# EAGLE design SOLoRa (EAGLE 9.1.0)
COMPANY: ADAFRUIT INDUSTRIES; DRAWN: KTOWN; REV: B

## Sheet 1 of 2
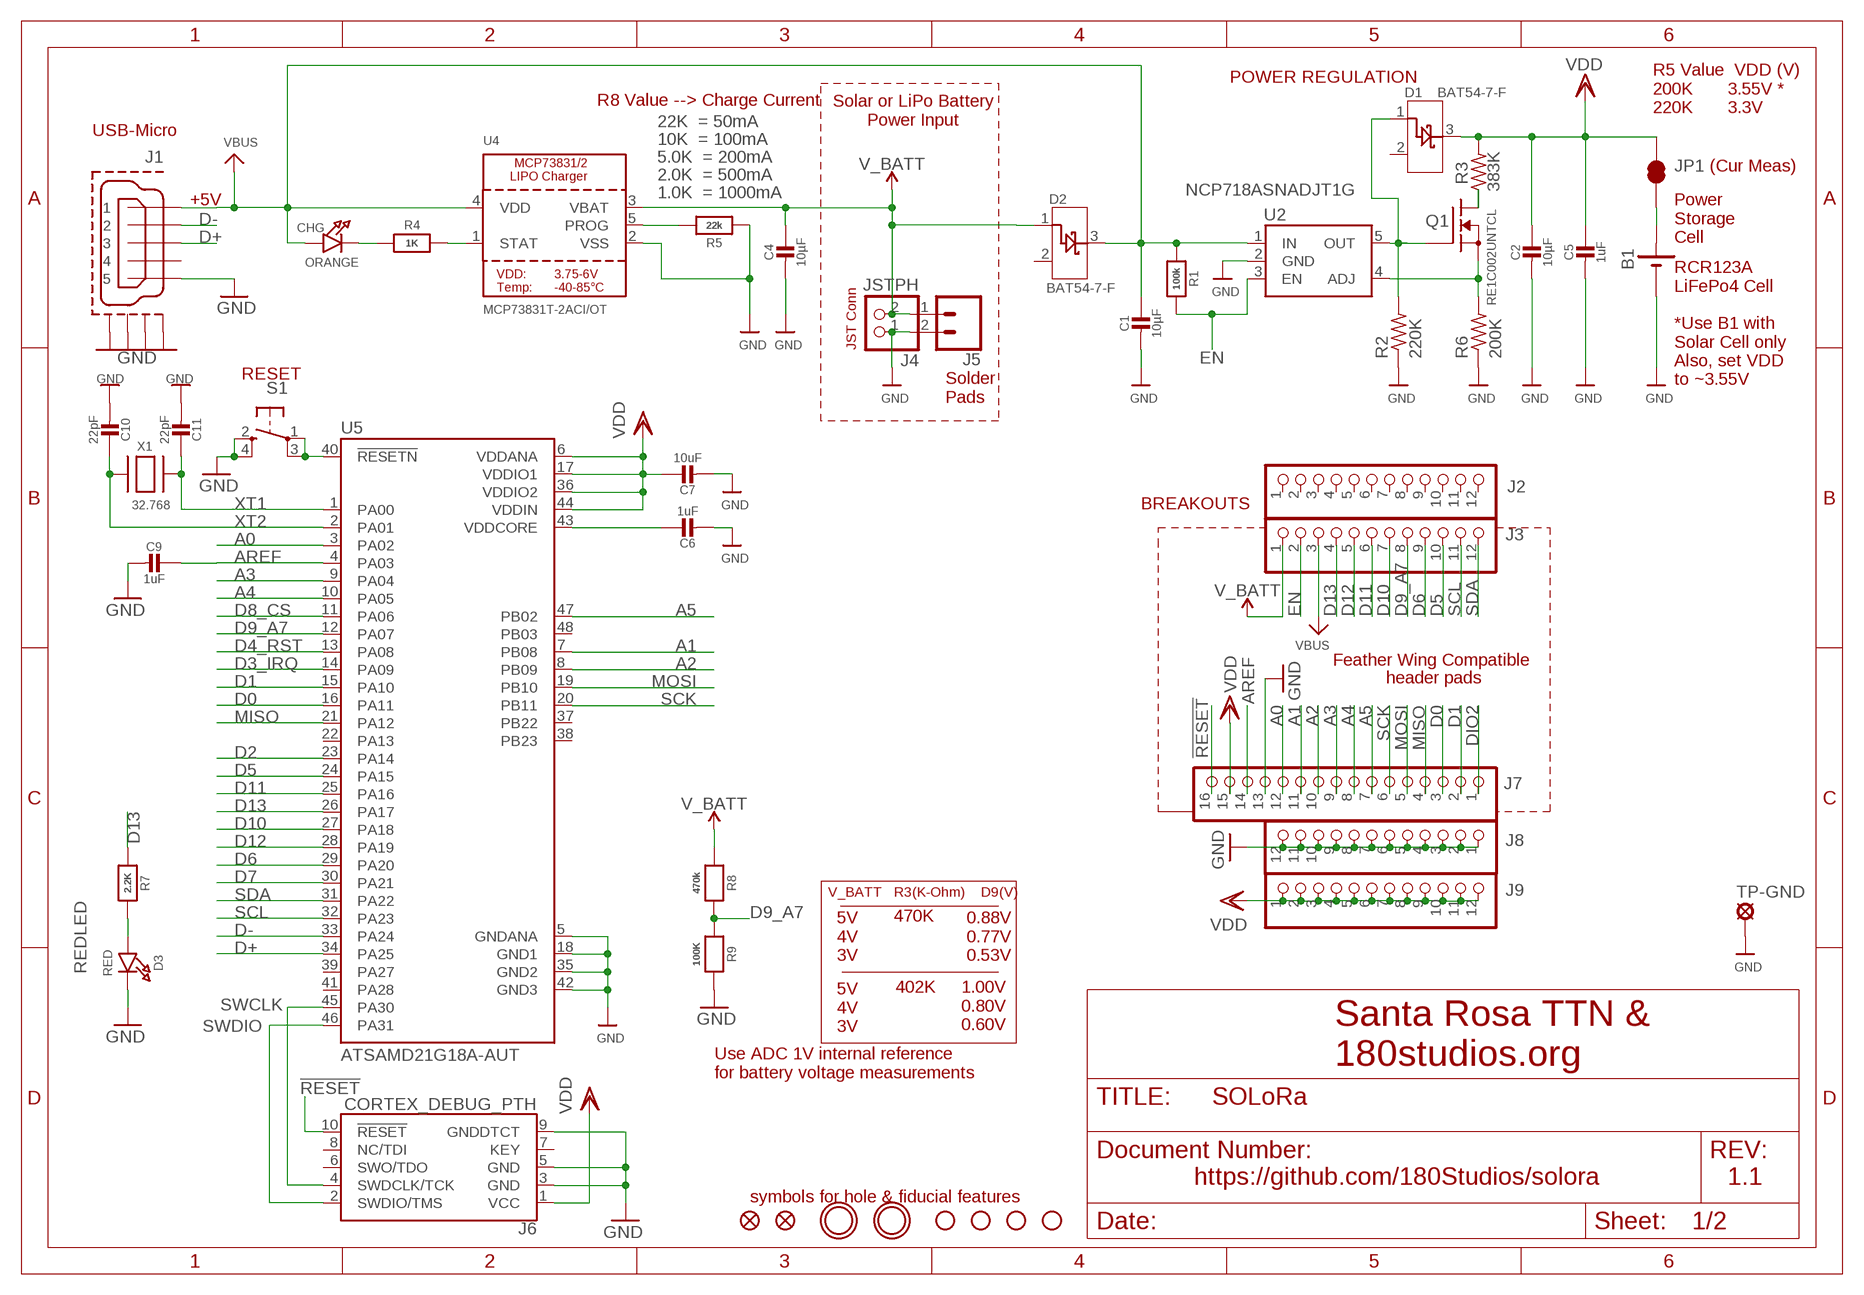
[diagram p0: schematic, sheet 1]

### Parts
$$U$1  FIDUCIAL""  [FIDUCIAL_1MM]
$$U$2  MOUNTINGHOLE2.5  [MOUNTINGHOLE_2.5_PLATED]
$$U$3  MOUNTINGHOLE2.5  [MOUNTINGHOLE_2.5_PLATED]
$$U$4  FIDUCIAL""  [FIDUCIAL_1MM]
B1  BH123A  [BH123A]
C1  10µF  CAP_CERAMIC0805-NOOUTLINE  [0805-NO]
C2  10µF  CAP_CERAMIC0805-NOOUTLINE  [0805-NO]
C4  10µF  CAP_CERAMIC0805-NOOUTLINE  [0805-NO]
C5  1uF  CAP_CERAMIC0603_NO  [0603-NO]
C6  1uF  CAP_CERAMIC0603_NO  [0603-NO]
C7  10uF  CAP_CERAMIC0805-NOOUTLINE  [0805-NO]
C9  1uF  CAP_CERAMIC0603_NO  [0603-NO]
C10  22pF  CAP_CERAMIC0603_NO  [0603-NO]
C11  22pF  CAP_CERAMIC0603_NO  [0603-NO]
CHG  ORANGE  LED0805_NOOUTLINE  [CHIPLED_0805_NOOUTLINE]
D1  BAT54-7-F  [SOT-23]
D2  BAT54-7-F  [SOT-23]
D3  RED  LED0805_NOOUTLINE  [CHIPLED_0805_NOOUTLINE]
H1  STAND-OFF  [STAND-OFF]
H2  STAND-OFF  [STAND-OFF]
H3  STAND-OFF  [STAND-OFF]
H4  STAND-OFF  [STAND-OFF]
J1  CONN_USB-MIRCO_10118194  [10118194_USB]
J2  HEADER-1X12  [1X12_ROUND]
J3  HEADER-1X12  [1X12_ROUND]
J4  JSTPH  CON_JST_PH_2PIN  [JSTPH2]
J5  CONN_021X02_NO_SILK  [1X02_NO_SILK]
J6  CORTEX_DEBUG_PTH  [2X5-PTH-1.27MM]
J7  HEADER-1X16ROUND  [1X16_ROUND]
J8  HEADER-1X12  [1X12_ROUND]
J9  HEADER-1X12  [1X12_ROUND]
JP1  JUMPER-SMT_2_NC_TRACE_NO-SILK  [SMT-JUMPER_2_NC_TRACE_NO-SILK]
Q1  RE1C002UNTCL  [SOT50P160X85-3N]
R1  100k  RESISTOR_0603_NOOUT  [0603-NO]
R2  220K  R-US_R0603  [R0603]
R3  383K  R-US_R0603  [R0603]
R4  1K  RESISTOR_0603_NOOUT  [0603-NO]
R5  22k  RESISTOR_0603_NOOUT  [0603-NO]
R6  200K  R-US_R0603  [R0603]
R7  2.2K  RESISTOR_0603_NOOUT  [0603-NO]
R8  470k  RESISTOR_0603_NOOUT  [0603-NO]
R9  100K  RESISTOR_0603_NOOUT  [0603-NO]
S1  SPST_TACT-KMR2  [KMR2]
TP-GND  SE14  [SE14]
U2  NCP718ASNADJT1G  [SOT95P280X100-5N]
U4  MCP73831T-2ACI/OT  MCP73831/2  [SOT23-5]
U5  ATSAMD21G18A-AUT  [QFP50P900X900X120-48N]
X1  32.768  XTAL-3.2X1.5  [XTAL3215]

### Nets
!RESET: J6.10(!RESET) J7.16 S1.1(P) S1.3(P1) U5.40(!RESETN)
A0: J7.12 U5.3(PA02)
A1: J7.11 U5.7(PB08)
A2: J7.10 U5.8(PB09)
A3: J7.9 U5.9(PA04)
A4: J7.8 U5.10(PA05)
A5: J7.7 U5.47(PB02)
ADJ1: Q1.3(D) R3.1
AREF: C9.1 J7.14 U5.4(PA03)
CHGLED: CHG.C R4.1
D0: J7.3 U5.16(PA11)
D1: J7.2 U5.15(PA10)
D2: U5.23(PA14)
D3_IRQ: U5.14(PA09) ; also sheet 2
D4_RST: U5.13(PA08) ; also sheet 2
D5: J3.10 U5.24(PA15)
D6: J3.9 U5.29(PA20) ; also sheet 2
D7: U5.30(PA21)
D8_CS: U5.11(PA06) ; also sheet 2
D9_A7: J3.8 R8.2 R9.1 U5.12(PA07)
D10: J3.7 U5.27(PA18)
D11: J3.6 U5.25(PA16) ; also sheet 2
D12: J3.5 U5.28(PA19)
D13: J3.4 R7.1 U5.26(PA17)
D+: J1.3 U5.34(PA25)
D-: J1.2 U5.33(PA24)
DIO2: J7.1 ; also sheet 2
EN: J3.2 R1.2 U2.3(EN)
GND [Power]: B1.MINUS C1.2 C2.2 C4.2 C5.2 C6.2 C7.2 C9.2 C10.2 C11.2 D3.C J1.5 J1.6(GND1) J1.7(GND2) J1.8(GND3) J1.9(GND4) J4.1 J5.2 J6.3(GND) J6.5(GND) J6.9(GNDDTCT) J7.13 J8.1 J8.2 J8.3 J8.4 J8.5 J8.6 J8.7 J8.8 J8.9 J8.10 J8.11 J8.12 R2.1 R5.2 R6.1 R9.2 S1.2(S) S1.4(S1) TP-GND.MP U2.2(GND) U4.2(VSS) U5.5(GNDANA) U5.18(GND1) U5.35(GND2) U5.42(GND3) ; also sheet 2
MISO: J7.4 U5.21(PA12) ; also sheet 2
MOSI: J7.5 U5.19(PB10) ; also sheet 2
PLUS [Power]: B1.PLUS JP1.1
PROG: R5.1 U4.5(PROG)
REDLED: D3.A R7.2
REGADJ: Q1.2(S) R6.2 U2.4(ADJ)
REGOUT: D1.1(EPAD1) Q1.1(G) R2.2 U2.5(OUT)
SCK: J7.6 U5.20(PB11) ; also sheet 2
SCL: J3.11 U5.32(PA23) ; also sheet 2
SDA: J3.12 U5.31(PA22) ; also sheet 2
STAT: R4.2 U4.1(STAT)
SWCLK: J6.4(SWDCLK/TCK) U5.45(PA30)
SWDIO: J6.2(SWDIO/TMS) U5.46(PA31)
V_BATT: C4.1 D2.1(EPAD1) J3.1 J4.2 J5.1 R8.1 U4.3(VBAT)
VBUS: C1.1 CHG.A D2.3(EPAD3) J1.1 J3.3 R1.1 U2.1(IN) U4.4(VDD)
VDD [Power]: C2.1 C5.1 C7.1 D1.3(EPAD3) J6.1(VCC) J7.15 J9.1 J9.2 J9.3 J9.4 J9.5 J9.6 J9.7 J9.8 J9.9 J9.10 J9.11 J9.12 JP1.2 R3.2 U5.6(VDDANA) U5.17(VDDIO1) U5.36(VDDIO2) U5.44(VDDIN) ; also sheet 2
VDDCORE: C6.1 U5.43(VDDCORE)
XT1: C11.1 U5.1(PA00) X1.P$1
XT2: C10.1 U5.2(PA01) X1.P$2
Unconnected: D1.2(EPAD2) D2.2(EPAD2) J1.4 J2.1 J2.2 J2.3 J2.4 J2.5 J2.6 J2.7 J2.8 J2.9 J2.10 J2.11 J2.12 J6.6(SWO/TDO) J6.7(KEY) J6.8(NC/TDI) U5.22(PA13) U5.37(PB22) U5.38(PB23) U5.39(PA27) U5.41(PA28) U5.48(PB03)

### Notes on the sheet
- POWER REGULATION
- R8 Value --> Charge Current
- R5 Value  VDD (V)
  200K       3.55V *
  220K       3.3V
- Solar or LiPo Battery
  Power Input
- 22K  = 50mA
- USB-Micro
- 10K  = 100mA
- 5.0K  = 200mA
- (Cur Meas)
- 2.0K  = 500mA
- 1.0K  = 1000mA
- +5V
- Power
  Storage
  Cell
- JST Conn
- RESET
- RCR123A
  LiFePo4 Cell
  
  *Use B1 with 
  Solar Cell only 
  Also, set VDD
  to ~3.55V
- Solder
  Pads
- BREAKOUTS
- Feather Wing Compatible
- header pads
- V_BATT   R3(K-Ohm)    D9(V)
- 470K
- 5V
  4V
  3V
- 0.88V
  0.77V
  0.53V
- 402K
- 1.00V
  0.80V
  0.60V
- 5V
  4V
  3V
- Santa Rosa TTN &
  180studios.org
- Use ADC 1V internal reference
  for battery voltage measurements
- https://github.com/180Studios/solora | 1.1
- symbols for hole & fiducial features

## Sheet 2 of 2
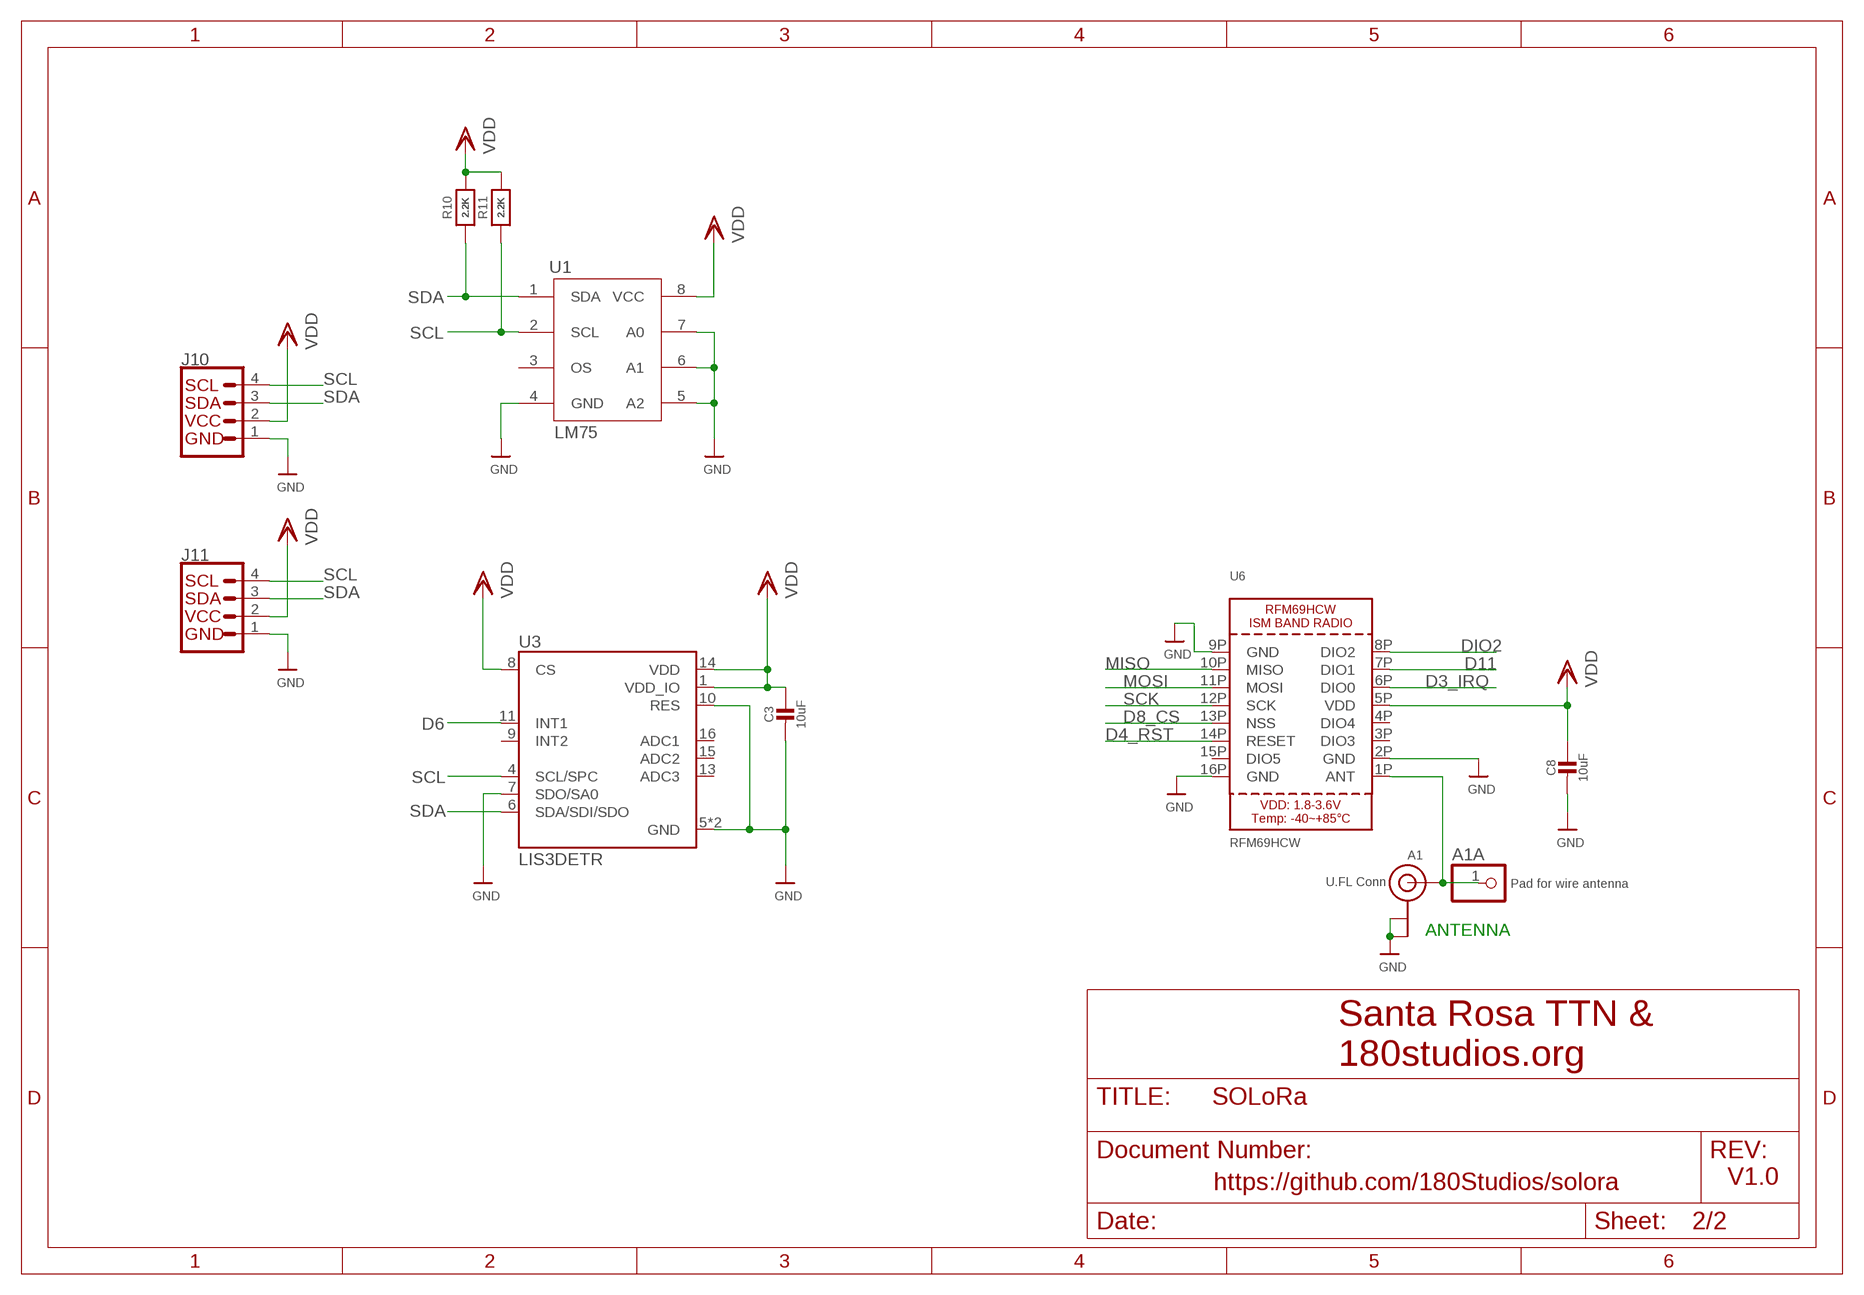
[diagram p1: schematic, sheet 2]

### Parts
A1  U.FL Conn  ANTENNA_U.FL  [U.FL]
A1A  Pad for wire antenna  HEADER-1X1ROUND  [1X01_ROUND]
C3  10uF  CAP_CERAMIC0805-NOOUTLINE  [0805-NO]
C8  10uF  CAP_CERAMIC0805-NOOUTLINE  [0805-NO]
J10  QWIIC_CONNECTORJS-1MM  [1X04_1MM_RA]
J11  QWIIC_CONNECTORJS-1MM  [1X04_1MM_RA]
R10  2.2K  RESISTOR_0603_NOOUT  [0603-NO]
R11  2.2K  RESISTOR_0603_NOOUT  [0603-NO]
U1  LM75  [SO8]
U3  LIS3DETR  [LGA16R50P5X3_300X300X100N]
U6  RFM69HCW  RFM69HCW_SMT  [RFMHCW_SMT]

### Nets
ANT: A1.3(SIGNAL) A1A.1 U6.1P(ANT)
D3_IRQ: U6.6P(DIO0) ; also sheet 1
D4_RST: U6.14P(RESET) ; also sheet 1
D6: U3.11(INT1) ; also sheet 1
D8_CS: U6.13P(NSS) ; also sheet 1
D11: U6.7P(DIO1) ; also sheet 1
DIO2: U6.8P(DIO2) ; also sheet 1
GND [Power]: A1.1(GND) A1.2(GND) C3.2 C8.2 J10.1 J11.1 U1.4(GND) U1.5(A2) U1.6(A1) U1.7(A0) U3.5(GND) U3.7(SDO/SA0) U3.10(RES) U3.12(GND) U6.2P(GND) U6.9P(GND) U6.16P(GND) ; also sheet 1
MISO: U6.10P(MISO) ; also sheet 1
MOSI: U6.11P(MOSI) ; also sheet 1
SCK: U6.12P(SCK) ; also sheet 1
SCL: J10.4 J11.4 R11.1 U1.2(SCL) U3.4(SCL/SPC) ; also sheet 1
SDA: J10.3 J11.3 R10.1 U1.1(SDA) U3.6(SDA/SDI/SDO) ; also sheet 1
VDD [Power]: C3.1 C8.1 J10.2 J11.2 R10.2 R11.2 U1.8(VCC) U3.1(VDD_IO) U3.8(CS) U3.14(VDD) U6.5P(VDD) ; also sheet 1
Unconnected: U1.3(OS) U3.9(INT2) U3.13(ADC3) U3.15(ADC2) U3.16(ADC1) U6.3P(DIO3) U6.4P(DIO4) U6.15P(DIO5)

### Notes on the sheet
- ANTENNA
- Santa Rosa TTN &
  180studios.org
- https://github.com/180Studios/solora | V1.0

## Library data of the parts
$$U$1 $$U$4 = microbuilder:FIDUCIAL: Fiducial Alignment Points Various fiducial points for machine vision alignment.; BOM: EXCLUDE
$$U$2 $$U$3 = microbuilder:MOUNTINGHOLE: Mounting Hole For #2 screws (0.086"/2.18mm width, 0.094"/2.4mm hole) use 2.5mm; BOM: EXCLUDE
A1 = microbuilder:ANTENNA_U.FL: U.FL Antenna Connector
A1A = microbuilder:HEADER-1X1: PIN HEADER
B1 = _Joes:BH123A
C1-C11 = microbuilder:CAP_CERAMIC: Ceramic Capacitors For new designs, use the packages preceded by an '_' character since they are more reliable: The following footprints should be used on most boards: _0402 - Standard footprint for regular board layouts _0603 - Standard footprint for regular board layouts _0805 - Standard footprint for regular board layouts _1206 - Standard footprint for regular board layouts For extremely tight-pitch boards where space is at a premium, the following 'micro-pitch' footprints can be used (smaller pads, no silkscreen outline, etc.): _0402MP - Micro-pitch footprint for very dense/compact boards _0603MP - Micro-pitch footprint for very dense/compact boards _0805MP - Micro-pitch footprint for very dense/compact boards _1206MP - Micro-pitch footprint for very dense/compact boards
CHG D3 = microbuilder:LED: LED 0603 - 0603 Surface Mount Package 2mA: Green LED - Low Power (3.9mcd, 2ma, 1.7Vf) - Digikey: 475-2709-2-ND Orange LED - Low Power (9.8mcd, 2ma, 1.8Vf) - Digikey: 475-1194-2-ND Red LED - Low Power (5mcd, 2ma, 1.8Vf) - Digikey: 475-1195-2-ND Yellow LED - Low Power (7mcd, 2ma, 1.8Vf) - Digikey: 475-1196-2-ND 5mA: Blue LED - Low Power (17mcd, 5ma, 2.9Vf) - Digikey: LNJ937W8CRACT-ND 0805 - 0805 Surface Mount Package 2mA: Red LED (8.8mcd, 2mA, 1.8Vf, Clear) - Low Power [Digikey: 475-2510-1-ND] Green LED (5mcd, 2mA, 1.8Vf, Clear) - Low Power [Digikey: 475-2730-1-ND] Yellow LED (11.3mcd, 2mA, 1.8Vf, Clear) - Low Power [Digikey: 475-2555-1-ND] 20mA: Red LED (104mcd, 20mA, Diffused) - LS R976 [Digikey: 475-1278-6-ND] Red LED (12mcd, 20mA, 2.0Vf, Clear) - APT2012EC [Digikey: 754-1128-1-ND] Green LED (15mcd, 20mA, 2.2Vf, Clear) - APT2012GC [Digikey: 754-1131-1-ND] Orange LED (160mcd, 20mA, 2.1Vf, Clear) - APT2012SECK [Digikey: 754-1130-1-ND] 1206 - 1206 Surface Mount Package Green LED (26mcd, 20mA, Diffused) - LG N971 [Digikey: 475-1407-6-ND] Red LED (15mcd, 20mA, Diffused) - LH N974 [Digikey: 475-1416-6-ND] Cree - Cree High-Power Surface Mount LEDs XPEBWT-L1-0000-00D50 - White 111lm 350mA 2.9Vf 6200K 110° XTEAWT-00-0000-00000LEE3 - White 114lm 350mA 2.85Vf 5000K 115° Everlight - Everlight 45-21 Series Surface Mount LEDs 45-21/QK2C-B2832AC2CB2/2T - Warm White 2000mcd 20mA 3.25Vf 3050K 120° 45-21/LK2C-B38452C4CB2/2T - Nuetral White 2000mcd 20mA 3.25Vf 4150K 120° 45-21/LK2C-B50634C6CB2/2T - Cold White 2200mcd 20mA 3.25Vf 5650K 120° PLCC2 Reverse Mount LS T77K-J1L2-1-0-2-R18-Z - Red 11.25mcd 2mA 1.8Vf 630nm 120° LO T77K-L1M2-24-Z - Orange 19.6mcd 2mA 1.8Vf 606nm 120° LY T77K-K2M1-26-Z - Yellow 15.7mcd 2mA 1.8Vf 587nm 120°
D1 D2 = _Joes:BAT54-7-F; MANUFACTURER_PART_NUMBER: BAT547F; VENDOR: Diodes Inc
H1-H4 = SparkFun-Hardware:STAND-OFF: Stand Off Drill holes for mechanically mounting via screws, standoffs, etc. Note: Use the keepout ring to avoid running the screw head into surrounding components. Variant Overviews STAND-OFF - Mechanical footprint for a #4 phillips button head screw. STAND-OFF-TIGHT - Mechanical footprint for a #4 phillips button head screw, Example SparkFun Products Screw - Phillips Head (1/4", 4-40, 10 pack) <https://www.sparkfun.com/products/10453> (PRT-10453) Screw - Phillips Head (1/2", 4-40, 10 pack) <https://www.sparkfun.com/products/10452> (PRT-10452) Screw - Phillips Head (3/4", 4-40, 10 pack) <https://www.sparkfun.com/products/10451> (PRT-10451) Screw - Phillips Head (1", 4-40, 10 pack) <https://www.sparkfun.com/products/10450> (PRT-10450)
J1 = _Joes:CONN_USB-MIRCO_10118194: CONN USB Micro Receptical SMT & PTH R/A Ampenol FCI 10118194-001LF
J2 J3 J8 J9 = microbuilder:HEADER-1X12
J4 = microbuilder:CON_JST_PH_2PIN: JST 2-Pin Right-Angle Connector PH-Series - 4UConnector: 17311 SH-Series - 4UConnector: 07278
J5 = SparkFun-Connectors:CONN_02: Multi connection point. Often used as Generic Header-pin footprint for 0.1 inch spaced/style header connections On any of the 0.1 inch spaced packages, you can populate with these: Break Away Headers - Straight <https://www.sparkfun.com/products/116> (PRT-00116) Break Away Male Headers - Right Angle <https://www.sparkfun.com/products/553> (PRT-00553) Female Headers <https://www.sparkfun.com/products/115> (PRT-00115) Break Away Headers - Machine Pin <https://www.sparkfun.com/products/117> (PRT-00117) Break Away Female Headers - Swiss Machine Pin <https://www.sparkfun.com/products/743> (PRT-00743) For SCREWTERMINALS and SPRING TERMINALS visit here: Screw Terimnals on SparkFun.com <https://www.sparkfun.com/search/results?term=Screw+Terminals> (5mm/3.5mm/2.54mm spacing) This device is also useful as a general connection point to wire up your design to another part of your project. Our various solder wires solder well into these plated through hole pads. Hook-Up Wire - Assortment (Stranded, 22 AWG) <https://www.sparkfun.com/products/11375> (PRT-11375) Hook-Up Wire - Assortment (Solid Core, 22 AWG) <https://www.sparkfun.com/products/11367> (PRT-11367) View the entire wire category on our website here <https://www.sparkfun.com/categories/141> Special notes: Molex polarized connector foot print use with: PRT-08233 with associated crimp pins and housings. 2.54_SCREWTERM for use with PRT-10571. 3.5mm Screw Terminal footprints for PRT-08084 5mm Screw Terminal footprints for use with PRT-08432
J6 = SparkFun-Connectors:CORTEX_DEBUG: Cortex Debug Connector - 10 pin Supports JTAG debug, Serial Wire debug, and Serial Wire Viewer. PTH and SMD connector options available. General Connector Information <http://infocenter.arm.com/help/topic/com.arm.doc.faqs/attached/13634/cortex_debug_connectors.pdf> Products: PTH Connector <http://www.digikey.com/product-detail/en/cnc-tech/3220-10-0100-00/1175-1627-ND/3883661> -via Digi-Key SparkFun PSoc <https://www.sparkfun.com/products/13229> SparkFun T <https://www.sparkfun.com/products/13810>
J7 = microbuilder:HEADER-1X16: PIN HEADER
J10 J11 = SparkFun-Connectors:QWIIC_CONNECTOR: SparkFun I2C Standard Qwiic Connector An SMD 1mm pitch JST connector makes it easy and quick (get it? Qwiic?) to connect I2C devices to each other. The Qwiic system <http://www.sparkfun.com/qwiic> enables fast and solderless connection between popular platforms and various sensors and actuators. We carry 200mm <https://www.sparkfun.com/products/14204>, 100mm <https://www.sparkfun.com/products/14205>, 50mm <https://www.sparkfun.com/products/14206>, and breadboard friendly <https://www.sparkfun.com/products/14207> Qwiic cables. We also offer 10 pcs strips <https://www.sparkfun.com/products/14323> the SMD connectors.; PROD_ID: CONN-13694
JP1 = SparkFun-Jumpers:JUMPER-SMT_2_NC_TRACE: Normally closed trace jumper This jumper has a trace between two pads so it's normally closed (NC). Use a razor knife to open the connection. For best results follow the IPC guidelines for cutting traces: Cutout at least 0.063 mm (0.005 in). Remove all loose material to clean up the cut area. Seal the cut with an approved epoxy. Reapply solder to reclose the connection.
Q1 = SamacSys_Parts:RE1C002UNTCL: MOSFET 1.2V Drive Nch MOSFET Source: Datasheet <http://rohmfs.rohm.com/en/products/databook/datasheet/discrete/transistor/mosfet/re1c002un.pdf>; ARROW_PART_NUMBER: RE1C002UNTCL; ARROW_PRICE/STOCK: http://uk.rs-online.com/web/p/products/1246784P; DESCRIPTION: MOSFET 1.2V Drive Nch MOSFET; HEIGHT: 0.85mm; MANUFACTURER_NAME: ROHM Semiconductor; MANUFACTURER_PART_NUMBER: RE1C002UNTCL; RS_PART_NUMBER: 1246784P; RS_PRICE/STOCK: http://uk.rs-online.com/web/p/products/1246784P
R1 R4 R5 R7-R11 = microbuilder:RESISTOR: Resistors For new designs, use the packages preceded by an '_' character since they are more reliable: The following footprints should be used on most boards: _0402 - Standard footprint for regular board layouts _0603 - Standard footprint for regular board layouts _0805 - Standard footprint for regular board layouts _1206 - Standard footprint for regular board layouts For extremely tight-pitch boards where space is at a premium, the following 'micro-pitch' footprints can be used (smaller pads, no silkscreen outline, etc.): _0402MP - Micro-pitch footprint for very dense/compact boards _0603MP - Micro-pitch footprint for very dense/compact boards _0805MP - Micro-pitch footprint for very dense/compact boards _1206MP - Micro-pitch footprint for very dense/compact boards
R2 R3 R6 = rcl:R-US_: RESISTOR, American symbol; SPICEPREFIX: R
S1 = adafruit:SPST_TACT: SMT 6mm switch, EVQQ2 series http://www.ladyada.net/library/eagle
TP-GND = solpad:SE14: SOLDER PAD E1553, drill 1,4mm, distributor Buerklin, 07F820
U1 = _Joes:LM75
U2 = SamacSys_Parts:NCP718ASNADJT1G: LDO Regulator, 300 mA, Low Iq, Wide Input Voltage Adjustable, Active Discharge Source: Datasheet <http://www.onsemi.com/pub/Collateral/NCP718-D.PDF>; ARROW_PART_NUMBER: NCP718ASNADJT1G; ARROW_PRICE/STOCK: https://www.arrow.com/en/products/ncp718asnadjt1g/on-semiconductor; DESCRIPTION: LDO Regulator, 300 mA, Low Iq, Wide Input Voltage Adjustable, Active Discharge; HEIGHT: 1mm; MANUFACTURER_NAME: ON Semiconductor; MANUFACTURER_PART_NUMBER: NCP718ASNADJT1G; RS_PART_NUMBER: 1723327; RS_PRICE/STOCK: http://uk.rs-online.com/web/p/products/1723327
U3 = LIS3DETR:LIS3DETR: MEMS digital output motion sensor ultra low-power high performance 3-axes "nano" accelerometer; DESCRIPTION: MEMS digital output motion sensor ultra low-power high performance 3-axes nano accelerometer; DIGI-KEY_PART_NUMBER: 497-16262-1-ND; DIGI-KEY_PURCHASE_URL: https://www.digikey.com/product-detail/en/stmicroelectronics/LIS3DETR/497-16262-1-ND/5799914?utm_source=snapeda&utm_medium=aggregator&utm_campaign=symbol; MF: STMicroelectronics; MP: LIS3DETR; PACKAGE: LGA-16 STMicroelectronics
U4 = microbuilder:MCP73831/2: MCP73831/2 LIPO Charger VDD: 3.75 - 6V Temp -40 - 85°C Programmable Charge Rate: 15-500mA NOTE: STAT is a tri-state logic output on the MCP73831 and an open-drain output on the MCP73832. SOT23-5 with 4.2V output and tri-state logic on STAT = MCP73831T-2ACI/OT
U5 = _Joes:ATSAMD21G18A-AUT: Cortex-M0+, 256KB FLASH, 32KB SRAM, USB, DMA, T&R - 48TQFP IND TEMP, GREEN, 1.6-3.6V, 48MHz; DESCRIPTION: MCU 32-bit SAM D21 ARM Cortex M0+ RISC 256KB Flash 3.3V 48-Pin TQFP T/R; DIGI-KEY_PART_NUMBER: ATSAMD21G18A-AUTCT-ND; DIGI-KEY_PURCHASE_URL: https://www.digikey.com/product-detail/en/microchip-technology/ATSAMD21G18A-AUT/ATSAMD21G18A-AUTCT-ND/4878879?utm_source=snapeda&utm_medium=aggregator&utm_campaign=symbol; MF: Microchip; MP: ATSAMD21G18A-AUT; PACKAGE: TQFP-48 Microchip
U6 = microbuilder:RFM69HCW: RFM69HCW - ISM Band RF Transceiver
X1 = adafruit2:XTAL: Low cost SMT crystals, no capacitors included http://www.ladyada.net/library/eagle

## Net classes
0 default: width 0.152 mm, drill 0.35 mm, clearance 0.152 mm
1 Power: width 0.406 mm, drill 0.35 mm, clearance 0.152 mm

## Board
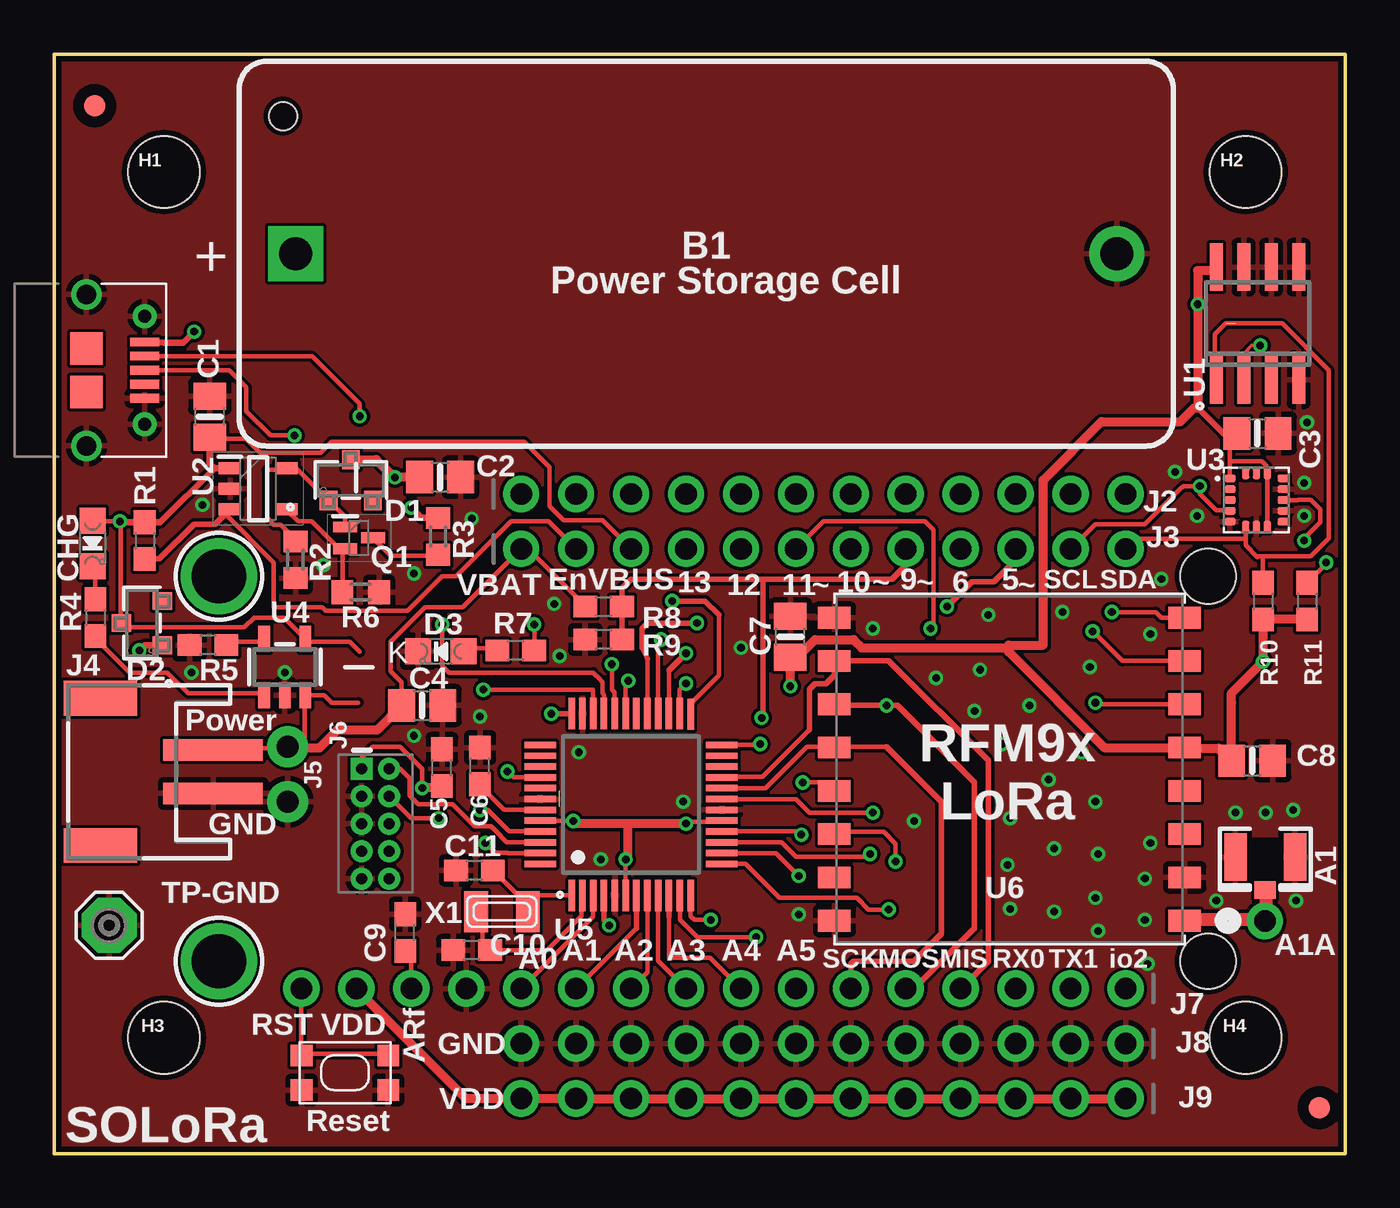
[diagram p2: board, top side]
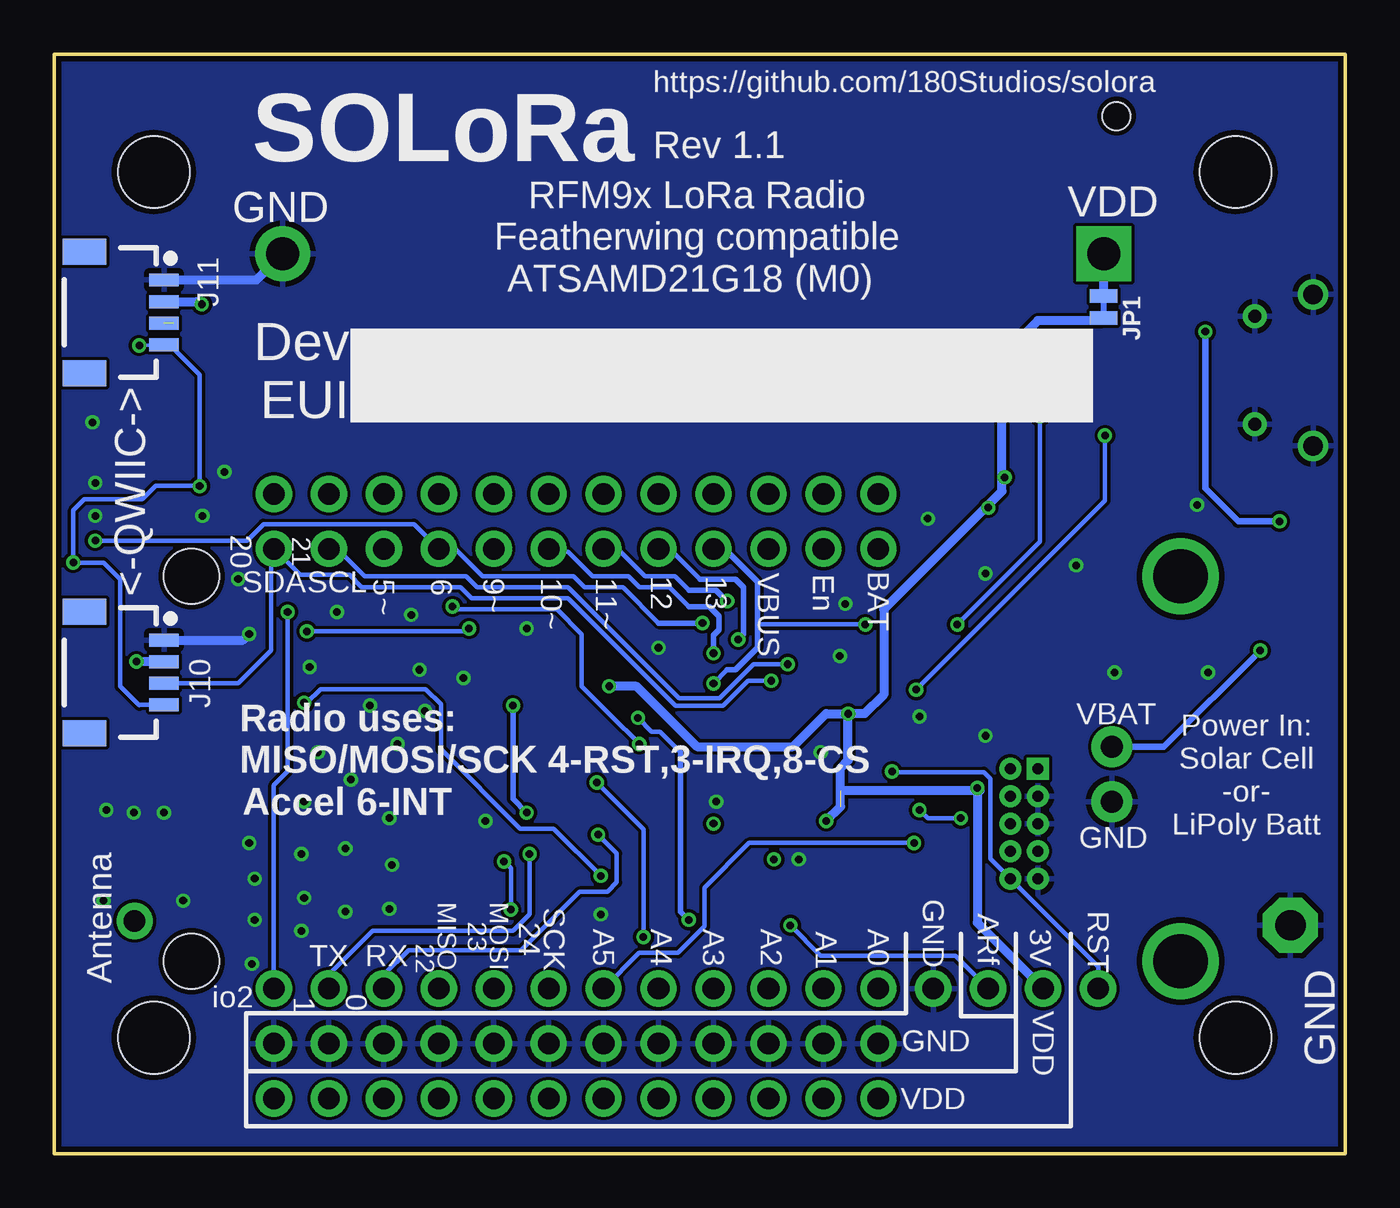
[diagram p3: board, bottom side, seen from below]

Size 59.69 x 50.8 mm. Coordinates in mm from the lower left corner, seen from the top.
Outline: 0,0 59.69,0 59.69,50.8 0,50.8 0,0
Copper layers (1*16): Top 0.035mm / dielectric 1.5mm / Bottom 0.035mm
Design rules "SeeedStudio_2layer_DRU_no_angle_20140221 *": minimum track width 6mil, minimum drill 12mil, track to track 6mil, track to pad 6mil, pad to pad 6mil, via to via 6mil, smd to smd 0mil, copper to edge 10mil, drill to drill 10mil, minimum pad ring 10mil, minimum via ring 6mil, stop-mask expansion 2mil, vias tented up to drill 100mil, thermal gap 10mil
Holes 2.54 mm at 53.34,26.67 53.34,8.89
tRestrict: area 30,13.1 to 30.1,15.1; area 30,16.3 to 30.1,18.9; area 25.8,19.4 to 29.5,19.6; area 23.2,17.3 to 23.4,18.9; area 23.2,16.8 to 23.4,17; area 23.2,15.7 to 23.4,16; area 23.2,13.2 to 23.4,15; area 23.7,12.7 to 25.5,12.8; area 26.8,12.7 to 29.5,12.8; area 24.8,19.4 to 25.7,19.6

### Footprints (pad centres in the part's own frame; a part is rotated, then mirrored left to right if it is on the bottom)
FIDUCIAL_1MM = smd 1 x 1: 1 0,0
MOUNTINGHOLE_2.5_PLATED = drill 2.5 pad 3.2: P$1 0,0
U.FL = smd 2.2 x 1.05: 1 0,1.375; 2 0,-1.375 | smd 0.8 x 1: 3 1.525,0
1X01_ROUND = drill 1 pad 1.676: 1 0,0
BH123A = drill 1.524 pad 2.54: MINUS -18.974,0 | drill 1.524 pad 2.54 square: PLUS 18.974,0 | hole 1.27: 19.558,-6.35
0805-NO = smd 1.24 x 1.5: 1 -0.95,0; 2 0.95,0
0603-NO = smd 1.1 x 1: 1 -0.85,0; 2 0.85,0
CHIPLED_0805_NOOUTLINE = smd 1.2 x 1.2: A 0,-1.05; C 0,1.05
SOT-23 = smd 0.813 x 0.889: 1 -1.025,-0.945; 2 1.025,-0.945; 3 0,0.945
STAND-OFF = hole 3.302: 0,0
10118194_USB = smd 0.4 x 1.35: 1 -1.3,0; 2 -0.65,0; 3 0,0; 4 0.65,0; 5 1.3,0 | drill 0.6: 6 -2.5,0; 7 2.5,0 | drill 0.9: 8 -3.5,-2.7; 9 3.5,-2.7 | smd 1.5 x 1.5: 10 -1,-2.7; 11 1,-2.7
1X12_ROUND = drill 1 pad 1.676: 1 -13.97,0; 2 -11.43,0; 3 -8.89,0; 4 -6.35,0; 5 -3.81,0; 6 -1.27,0; 7 1.27,0; 8 3.81,0; 9 6.35,0; 10 8.89,0; 11 11.43,0; 12 13.97,0
JSTPH2 = smd 1 x 4.6: 1 -1,-3.7; 2 1,-3.7 | smd 1.6 x 3.4: NC1 -3.4,1.5; NC2 3.4,1.5
1X02_NO_SILK = drill 1.016 pad 1.88: 1 0,0; 2 2.54,0
2X5-PTH-1.27MM = drill 0.508 pad 1 square: 1 -2.54,-0.635 | drill 0.508 pad 1: 2 -2.54,0.635; 3 -1.27,-0.635; 4 -1.27,0.635; 5 0,-0.635; 6 0,0.635; 7 1.27,-0.635; 8 1.27,0.635; 9 2.54,-0.635; 10 2.54,0.635
1X16_ROUND = drill 1 pad 1.676: 1 -19.05,0; 2 -16.51,0; 3 -13.97,0; 4 -11.43,0; 5 -8.89,0; 6 -6.35,0; 7 -3.81,0; 8 -1.27,0; 9 1.27,0; 10 3.81,0; 11 6.35,0; 12 8.89,0; 13 11.43,0; 14 13.97,0; 15 16.51,0; 16 19.05,0
1X04_1MM_RA = smd 0.6 x 1.35: 1 -1.5,0; 2 -0.5,0; 3 0.5,0; 4 1.5,0 | smd 1.2 x 2: NC1 2.8,-3.675; NC2 -2.8,-3.675
SMT-JUMPER_2_NC_TRACE_NO-SILK = smd 0.635 x 1.27: 1 -0.508,0; 2 0.508,0
SOT50P160X85-3N = smd 1.1 x 0.5: 1 -0.65,0.5; 2 -0.65,-0.5; 3 0.65,0
R0603 = smd 1 x 1.1: 1 -0.85,0; 2 0.85,0
KMR2 = smd 1 x 1: 1 2,0.8; 2 2,-0.8; 3 -2,0.8; 4 -2,-0.8
SE14 = drill 1.397 pad 2.54 octagon: MP 0,0
SO8 = smd 0.6 x 2.2: 1 -1.905,-2.6; 2 -0.635,-2.6; 3 0.635,-2.6; 4 1.905,-2.6; 5 1.905,2.6; 6 0.635,2.6; 7 -0.635,2.6; 8 -1.905,2.6
SOT95P280X100-5N = smd 1.05 x 0.55: 1 -1.3,0.95; 2 -1.3,0; 3 -1.3,-0.95; 4 1.3,-0.95; 5 1.3,0.95
LGA16R50P5X3_300X300X100N = smd 0.52 x 0.35: 1 -1.225,1; 2 -1.225,0.5; 3 -1.225,0; 4 -1.225,-0.5; 5 -1.225,-1; 9 1.225,-1; 10 1.225,-0.5; 11 1.225,0; 12 1.225,0.5; 13 1.225,1 | smd 0.35 x 0.52: 6 -0.5,-1.225; 7 0,-1.225; 8 0.5,-1.225; 14 0.5,1.225; 15 0,1.225; 16 -0.5,1.225
SOT23-5 = smd 0.55 x 1.2: 1 -0.95,-1.3; 2 0,-1.3; 3 0.95,-1.3; 4 0.95,1.3; 5 -0.95,1.3
QFP50P900X900X120-48N = smd 1.45 x 0.3: 1 -4.2,2.75; 2 -4.2,2.25; 3 -4.2,1.75; 4 -4.2,1.25; 5 -4.2,0.75; 6 -4.2,0.25; 7 -4.2,-0.25; 8 -4.2,-0.75; 9 -4.2,-1.25; 10 -4.2,-1.75; 11 -4.2,-2.25; 12 -4.2,-2.75; 25 4.17,-2.75; 26 4.2,-2.25; 27 4.2,-1.75; 28 4.2,-1.25; 29 4.2,-0.75; 30 4.2,-0.25; 31 4.2,0.25; 32 4.2,0.75; 33 4.2,1.25; 34 4.2,1.75; 35 4.2,2.25; 36 4.2,2.75 | smd 0.3 x 1.45: 13 -2.75,-4.2; 14 -2.25,-4.2; 15 -1.75,-4.2; 16 -1.25,-4.2; 17 -0.75,-4.2; 18 -0.25,-4.2; 19 0.25,-4.2; 20 0.75,-4.2; 21 1.25,-4.2; 22 1.75,-4.2; 23 2.25,-4.2; 24 2.75,-4.2; 37 2.75,4.2; 38 2.25,4.2; 39 1.75,4.2; 40 1.25,4.2; 41 0.75,4.2; 42 0.25,4.2; 43 -0.25,4.2; 44 -0.75,4.2; 45 -1.25,4.2; 46 -1.75,4.2; 47 -2.25,4.2; 48 -2.75,4.2
RFMHCW_SMT = smd 1.5 x 1: 1P 8.1,-7; 2P 8.1,-5; 3P 8.1,-3; 4P 8.1,-1; 5P 8.1,1; 6P 8.1,3; 7P 8.1,5; 8P 8.1,7; 9P -8.1,7; 10P -8.1,5; 11P -8.1,3; 12P -8.1,1; 13P -8.1,-1; 14P -8.1,-3; 15P -8.1,-5; 16P -8.1,-7
XTAL3215 = smd 1.1 x 1.9: P$1 1.2,0; P$2 -1.2,0

### Placement (x,y rotation side)
$$U$1  1.88,48.42 270 top
$$U$2  7.62,26.67 270 top
$$U$3  7.62,8.89 270 top
$$U$4  58.48,2.12 270 top
A1  55.98,13.7 270 top
A1A  55.97,10.75 0 top
B1  30.14,41.58 180 top
C1  7.2,34.04 90 top
C2  17.84,31.26 0 top
C3  55.63,33.27 0 top
C4  17.02,20.7 0 top
C5  17.92,17.83 90 top
C6  19.68,17.91 90 top
C7  34.04,23.88 90 top
C8  55.38,18.15 0 top
C9  16.23,10.21 90 top
C10  19.3,9.4 180 top
C11  19.43,13.08 180 top
CHG  1.78,28.19 180 top
D1  13.72,31.11 0 top
D2  4.06,24.51 90 top
D3  17.89,23.2 90 top
H1  5.08,45.35 0 top
H2  55.08,45.35 0 top
H3  5.08,5.35 0 top
H4  55.08,5.35 0 top
J1  4.19,36.2 270 top
J2  35.56,30.48 0 top
J3  35.56,27.94 0 top
J4  3.65,17.64 90 top
J5  10.79,18.8 270 top
J6  14.86,15.24 270 top
J7  30.48,7.62 180 top
J8  35.56,5.08 180 top
J9  35.56,2.54 180 top
J10  54.61,22.23 270 bottom
J11  54.61,38.86 270 bottom
JP1  11.18,39.12 270 bottom
Q1  14.1,28.45 0 top
R1  4.19,28.32 270 top
R2  11.16,27.44 90 top
R3  17.75,28.52 90 top
R4  1.91,24.77 270 top
R5  7.11,23.5 180 top
R6  14.17,25.94 180 top
R7  21.34,23.24 180 top
R8  25.4,25.27 0 top
R9  25.4,23.75 180 top
R10  55.88,25.53 270 top
R11  57.91,25.53 270 top
S1  13.45,3.73 0 top
TP-GND  2.54,10.54 0 top
U1  55.63,38.35 0 top
U2  9.43,30.72 0 top
U3  55.58,30.2 0 top
U4  10.67,22.48 0 top
U5  26.67,16.13 90 top
U6  44.16,17.76 0 top
X1  20.7,11.18 0 top

### Tracks (layer width: path | path; a pad name or v marks a point on that pad's centre or on a via)
!RESET  (via drill 0.35)
  Top 0.203: J7.16 11.43,4.6 S1.3 11.59,4.6 15.4,4.6 S1.1 | U5.40 21.23,17.38 v20.95,17.65
  Top 0.254: J7.16 11.56,7.62
  Bottom 0.203: 11.43,8.13 J7.16 11.43,8.64 J6.10 16.41,13.62 16.41,17.32 16.71,17.62 20.93,17.62 v20.95,17.65
A0
  Top 0.203: U5.3 24.92,10.95 J7.12
A1
  Top 0.203: 26.92,10.41 J7.11
  Top 0.254: U5.7 26.92,10.41
A2
  Top 0.203: U5.8 27.42,8.37 J7.10
A3
  Top 0.203: U5.9 27.92,8.91 J7.9
A4
  Top 0.203: J7.8 30.32,9.05 28.42,9.05 28.42,10.95
  Top 0.254: U5.10 28.42,10.95
A5  (via drill 0.35)
  Top 0.203: U5.47 20.96,13.88 20.96,13.89 20.4,13.89 v19.94,14.35
  Bottom 0.203: v19.94,14.35 27.56,14.35 29.62,12.29 29.62,10.49 30.84,9.27 32.64,9.27 J7.7
ADJ1
  Top 0.203: Q1.3 14.76,28.42 15.56,27.62 17.62,27.62 R3.1
ANT
  Top 0.203: 56.04,12.06 A1.3 | 56.04,10.79 A1A.1 55.88,10.79 52.39,10.79 U6.1P
  Top 0.61: 56.04,10.79 56.04,12.06 | 55.88,10.79 52.39,10.79
AREF  (via drill 0.35)
  Top 0.203: v25.65,10.54 25.4,10.79 25.42,10.79 | C9.1 16.51,9.26 J7.14
  Top 0.254: U5.4 25.42,10.79 25.42,10.78
  Bottom 0.203: v25.65,10.54 24.26,9.14 18.03,9.14 J7.14
CHGLED
  Top 0.203: R4.1 1.91,26.99 CHG.C
D0  (via drill 0.35)
  Top 0.203: U5.16 34.44,14.88
  Top 0.254: v34.54,14.73 34.56,14.75 34.44,14.88
  Bottom 0.203: 44.45,8.26 43.31,9.4 38.1,9.4 35.41,12.09 34.11,12.09 33.68,12.52 33.68,13.87 v34.54,14.73
  Bottom 0.254: 44.45,8.26 J7.3
D1  (via drill 0.35)
  Top 0.203: U5.15 33.63,14.38 34.29,13.72 37.59,13.72 v37.72,13.84
  Bottom 0.203: v37.72,13.84 37.72,11.05 38.48,10.29 44.96,10.29 46.99,8.26
  Bottom 0.254: 46.99,8.26 J7.2
D3_IRQ  (via drill 0.35)
  Top 0.203: U5.14 33.37,13.88 v34.42,12.83 | U6.6P 48.2,20.76 v48.13,20.83
  Bottom 0.203: v34.42,12.83 36.6,15.01 38.15,15.01 41.81,18.68 41.81,20.75 42.52,21.46 47.37,21.46 48.01,20.83 v48.13,20.83
D4_RST  (via drill 0.35)
  Top 0.203: U5.13 31.96,13.38 33.53,11.81 37.11,11.81 37.65,11.27 v38.58,11.27 | U6.14P 36.58,14.86 38.35,14.86 38.89,14.32 v38.89,13.49
  Bottom 0.203: v38.58,11.27 38.58,13.18 v38.89,13.49
D5  (via drill 0.35)
  Top 0.203: U5.24 32.59,18.88
  Top 0.254: v41.27,25.27 42.42,26.42 43.43,26.42 44.45,27.43 J3.10 | 32.59,18.88 v32.64,18.92
  Bottom 0.203: 41.15,25.15 36.45,25.15 35.31,24 35.31,21.59 33.97,20.26 v32.64,18.92
  Bottom 0.254: 41.15,25.15 v41.27,25.27
D6  (via drill 0.35)
  Top 0.203: U5.29 27.42,22.87 | v57.78,28.32 57.78,28.43 58.52,29.16 58.52,29.77 58.09,30.2 57.48,30.2 U3.11
  Top 0.254: 27.42,22.87 27.18,23.37 27.18,24.26 27.43,24.51 v29.72,24.51
  Bottom 0.203: 31.75,24.51 33.4,26.16 35.18,26.16 35.69,26.67 39.88,26.67 41.15,27.94 J3.9 43.05,29.08 50,29.08 50.77,28.32 v57.78,28.32
  Bottom 0.254: 31.75,24.51 v29.72,24.51
D8_CS  (via drill 0.35)
  Top 0.203: 28.94,11.91 28.94,10.8 29.74,10 v32.45,10 | v34.61,17.14 35.72,17.14 36.04,16.83 U6.13P
  Top 0.254: U5.11 28.94,11.91
  Bottom 0.203: v32.45,10 32.45,14.99 v34.61,17.14
D9_A7  (via drill 0.35)
  Top 0.203: U5.12 29.42,10.97 29.59,10.79 v30.35,10.79
  Top 0.254: J3.8 39.37,27.18 38.73,26.54 32.77,26.54 | R9.1 R8.2 26.25,26.12 26.67,26.54 32.77,26.54 | v32.7,20.13 32.77,20.19 32.77,26.54
  Bottom 0.203: 30.73,18.54 31.69,19.49 32.07,19.49 v32.7,20.13
  Bottom 0.254: 30.73,18.54 30.73,11.18 v30.35,10.79
D10  (via drill 0.35)
  Top 0.203: U5.27 28.42,22.32
  Top 0.254: 28.42,22.32 v29.21,23.11
  Bottom 0.203: 36.7,27.81 35.94,27.81 34.8,26.67 33.15,26.67 32.64,26.16 31.24,26.16 30.35,25.27
  Bottom 0.254: 36.7,27.81 J3.7 | 30.35,25.27 29.4,25.27 28.96,24.83 28.96,24.2 29.21,23.94 v29.21,23.11
D11  (via drill 0.35)
  Top 0.203: 29.42,20.78 30.73,22.1 30.73,24.89 | U6.7P 49.38,22.76 v48.01,24.13 | v40.51,24.26 40.64,24.38 40.64,28.83 40.26,29.21 35.56,29.21 J3.6
  Top 0.254: U5.25 29.42,20.78 | 30.73,24.89 30.1,25.53 v28.57,25.53
  Bottom 0.203: 30.35,26.04 30.99,26.67 32.38,26.67 33.66,27.94 | v40.51,24.26 40.64,24.13 v48.01,24.13
  Bottom 0.254: 33.66,27.94 J3.6 | v28.57,25.53 29.08,26.04 30.35,26.04
D12  (via drill 0.35)
  Top 0.203: U5.28 27.92,23.6
  Top 0.254: 27.92,23.6 v28.07,23.75
  Bottom 0.203: 31.24,27.94 29.84,26.54
  Bottom 0.254: J3.5 31.24,27.94 | 29.84,26.54 28.19,26.54 27.81,26.16 27.81,24 v28.07,23.75
D13  (via drill 0.35)
  Top 0.203: U5.26 28.92,21.43 v29.21,21.72 | v22.19,24.45 22.23,23.34 R7.1
  Bottom 0.203: 28.57,22.35 v29.21,21.72 | 27.18,24.45 v22.19,24.45
  Bottom 0.254: J3.4 28.7,27.94 27.18,26.42 27.18,24.45 27.18,23.37 28.19,22.35 28.57,22.35
D+  (via drill 0.35)
  Top 0.203: 6.48,36.2 6.6,36.2 | 6.6,36.2 8.1,36.2 8.89,35.4 8.89,34.29 10,33.18 v11.11,33.18 | 24.88,20.37 U5.34 24.92,20.48 24.92,21.43 v19.84,21.43 | J1.3 6.6,36.2
  Bottom 0.203: v19.84,21.43 11.11,30.16 v11.11,33.18
D-  (via drill 0.35)
  Top 0.203: U5.33 25.42,21.19 25.35,21.26 25.35,21.77 25.27,21.84 25.24,21.91 24.92,22.23 18.26,22.23 17.94,22.54 v17.94,24.45 | v14.13,34.07 14.13,34.64 11.94,36.83 4.21,36.83 J1.2
  Bottom 0.203: v17.94,24.45 14.13,28.26 v14.13,34.07
DIO2  (via drill 0.35)
  Top 0.203: U6.8P 51.19,24.76 50.93,25.02 v48.9,25.02
  Bottom 0.203: v48.9,25.02 48.9,17.65 49.53,17.02 J7.1
EN
  Top 0.203: J3.2 22.86,29.21 21.11,29.21 18.57,26.67 17.94,26.67 16.35,25.08 12.54,25.08 12.38,25.24 10.16,25.24 10.16,27.3 7.94,29.53 U2.3
  Top 0.254: R1.2 4.87,27.47 6.48,29.08 7.45,29.08 U2.3
GND  (via drill 0.35)
  Bottom 0.406: J11.1 50.33,40.36 B1.MINUS | J10.1 50.95,23.73 v50.67,24
  other vias: 24.26,18.54 29.08,16.26 34.42,11.05 37.85,24.26 50.67,14.35 48.26,13.84 50.55,8.76 48.26,10.29 47.5,18.54 45.09,20.7 43.81,18.92 44.2,11.3 44.2,15.49 47.88,22.48 51.18,26.54 43.18,24.89 46.61,25.02 42.8,22.35 40.77,21.97 42.55,20.45 46.23,11.18 46.23,14.1 44.07,13.34 48.13,16.26 48.13,11.81 45.97,17.27 10.67,22.23 6.86,29.97 6.35,22.23 25.27,13.59 16.64,19.3 19.68,20.19 39.75,15.37 57.78,30.99 57.78,29.46 57.91,33.78 51.82,31.5 52.83,29.46 12.45,27.18 16.64,26.8 19.3,29.34 23.11,25.4 54.61,15.75 57.28,15.88 56.01,15.75 57.4,11.68 53.72,11.68 50.42,12.7 50.42,10.79 31.75,23.37 23.37,22.99
  pour Top: 0.25,0.25 59.44,0.25 59.44,50.55 0.25,50.55
  pour Bottom: 0.25,0.25 59.44,0.25 59.44,50.55 0.25,50.55
MISO
  Top 0.203: 30.89,17.4 32.75,17.4 34.92,19.57
  Top 0.254: J7.4 43.18,8.89 43.18,18.16 38.56,22.78 36.1,22.78 U6.10P | U5.21 30.89,17.4 | U6.10P 36.07,22.1 35.69,21.72 35.18,21.72 34.92,21.46 34.92,19.57 | U6.10P
MOSI  (via drill 0.35)
  Top 0.203: U5.19 34.29,16.38 34.92,15.75 v37.85,15.75 | U6.11P 36.2,20.8 36.2,20.7
  Top 0.254: v38.48,20.7 38.4,20.78 | J7.5 39.75,7.62 42.55,10.41 42.55,17.14 38.99,20.7 v38.48,20.7 | 36.17,20.7 36.2,20.7 v38.48,20.7
  Bottom 0.254: v37.85,15.75 38.48,16.38 v38.48,20.7
PLUS
  Bottom 0.406: JP1.1 B1.PLUS
PROG
  Top 0.203: U4.5 9.68,23.65 8.41,23.65 8.19,23.5 R5.1
REDLED
  Top 0.203: R7.2 20.48,23.34 19.05,23.34 D3.A
REGADJ
  Top 0.203: U2.4 10.79,29.69 11.27,29.21 11.91,29.21 13.02,28.1 13.34,28.1 Q1.2 13.34,27.94 13.34,26.04 R6.2
REGOUT
  Top 0.203: 10.79,31.59 U2.5 | R2.2 11.11,28.42 10.48,29.05 10.16,29.05 9.84,29.37 9.84,31.59 10.64,31.59 U2.5 | 13.34,29.05 Q1.1 13.45,29.41 D1.1 11.19,31.67 U2.5
SCK
  Top 0.203: U5.20 32.88,16.88 34.8,18.8 36.04,18.8 | 36.04,18.8 38.48,18.8 | U6.12P 36.04,18.89 36.04,18.8
  Top 0.254: J7.6 36.83,8.76 36.96,8.89 39.75,8.89 41.02,10.16 41.02,16.26 38.48,18.8
SCL  (via drill 0.35)
  Top 0.152: 54.93,35.88 54.99,35.94 54.99,36.96 55.37,37.34 v55.75,37.34
  Top 0.203: 25.9,20.35 25.9,21.32 25.78,21.44 v25.78,22.61 | U1.2 54.93,35.88 | J3.11 48.13,29.08 50.42,29.08 52.1,30.76 52.12,30.76 52.2,30.84 v52.96,30.84 52.96,30.48 53.72,29.72 54.02,29.72 54.02,29.71 54.33,29.71 U3.4 | R11.1 58.84,27.3 | 58.84,27.3 58.93,27.3 | 58.84,27.3 v58.8,27.3
  Top 0.254: U5.32 25.9,20.35
  Bottom 0.152: 54.32,37.34 54.59,37.34 J11.4 54.63,37.34 v55.75,37.34
  Bottom 0.203: J3.11 46.61,27.94 45.34,26.67 40.64,26.67 40.13,26.16 35.94,26.16 30.81,21.03 28.93,21.03 27.36,22.61 v25.78,22.61 | 54.32,37.34 52.96,35.97 v52.96,30.84 52.98,30.86 54.99,30.86 55.63,30.23 58.29,30.23 58.8,29.72 v58.8,27.3 57.4,27.3 56.64,26.54 56.64,21.59 55.75,20.7 55.73,20.73 J10.4
SDA  (via drill 0.35)  (1 unrouted)
  Top 0.203: U5.31 26.42,21.59 v26.54,21.84 | J3.12 50.01,28.42 55.05,28.42 55.08,28.45 | U1.1 53.66,35.88 53.66,37.85 54.17,38.35 56.76,38.35 58.92,36.19 58.92,28.42 58.09,27.59 55.88,27.59 | 55.1,28.95 U3.6 55.08,28.45 | 55.08,28.45 55.08,28.11 55.63,27.56 55.65,27.59 55.88,27.59 | R10.1 55.88,27.59
  Bottom 0.203: v26.54,21.84 27.61,21.84 28.78,20.68 30.96,20.68 35.94,25.65 40.39,25.65 40.89,26.16 45.47,26.16 46.04,26.73 48.32,26.73 J3.12 49.66,27.81 49.66,23.26 51.19,21.73 J10.3
STAT
  Top 0.203: R4.2 1.91,23.81 3.49,22.23 5.24,22.23 6.19,21.27 9.68,21.27 U4.1
SWCLK  (via drill 0.35)
  Top 0.203: U5.45 21.02,14.88 20.03,15.88 v19.68,15.88 | J6.4 16.51,15.49 v17.78,15.49
  Bottom 0.203: v17.78,15.49 19.3,15.49 v19.68,15.88
SWDIO
  Top 0.203: U5.46 20.93,14.38 20.67,14.63 20.67,14.65 20.24,15.09 20.22,15.09 20.19,15.11 19.43,15.11 18.41,16.13 16.83,16.13 16.44,16.52 16.44,17.34 16,17.78 J6.2
V_BATT  (via drill 0.35)
  Top 0.203: R8.1 24.45,25.4 21.91,27.94 J3.1 18.89,25.24 17.14,25.24 15.56,23.65 15.56,22.29 16.07,21.78 C4.1 | J4.2 7.46,18.73 10.79,18.73 11.59,18.73 11.59,21.15 U4.3 12.48,21.18 12.83,20.83 14.06,20.83
  Top 0.305: D2.1 4.18,23.49 v3.94,23.24
  Top 0.406: C4.1 14.93,19.56 13.08,19.56 12.26,18.73 10.79,18.73 J5.1
  Bottom 0.305: v3.94,23.24 8.38,18.8 J5.1
VBUS  (via drill 0.35)
  Top 0.152: C1.1 7.27,33.02 7.75,33.02
  Top 0.203: 14.13,23.18 13.65,23.65 11.75,23.65 U4.4 11.59,23.81 10.64,24.77 9.24,24.77 8.79,24.32 3.08,24.32 3.08,24.38 | CHG.A 1.91,29.21 v3.05,29.21 3.08,29.19 3.08,24.38 | 7.64,33.02 7.75,33.02 8.89,33.02 9.53,32.38 12.32,32.38 12.83,32.89 21.72,32.89 22.23,32.38 22.91,31.7 22.91,29.9 23.55,29.26 25.35,29.26 J3.3 | D2.3 3.12,24.42 3.08,24.38
  Top 0.305: v3.05,29.21 3.05,29.17 R1.1 4.91,29.17 7.41,31.67 | 7.41,31.67 U2.1 | 7.41,31.67 7.2,31.88 C1.1 | J1.1 5.08,37.47 5.97,37.47 v6.48,37.97
  Bottom 0.305: v3.05,29.21 4.95,29.21 6.48,30.73 v6.48,37.97
VDD  (via drill 0.35)  (1 unrouted)
  Top 0.203: U5.44 22.48,15.37 v24,15.37 | U5.6 26.42,13.56 26.51,13.65 | U5.17 30.82,15.33 29.3,15.33 v29.21,15.24 | U3.8 U3.14 56.06,31.44 56.06,31.75 55.83,31.98 54.37,31.98 54.35,32 | 54.35,32.95 54.35,32 | 54.35,32 U3.1 | J6.1 14.22,18.29 14.73,18.8 16,18.8 17.02,17.78 v17.02,16.89
  Top 0.254: U5.36 v22.99,20.32 | 54.29,33.18 C3.1 54.35,32.95
  Top 0.305: 52.86,34.45 54.04,33.27 C3.1 | R3.2 16.99,29.36 v16.51,29.84
  Top 0.406: v34.04,21.59 C7.1 34.36,22.93 35.18,23.75 36.96,23.75 37.34,23.37 44.07,23.37 | C2.1 15.76,31.26 v15.75,31.24 15.73,31.23 14.9,32.06 D1.3 | C5.1 17.83,16.89 v17.02,16.89 | J9.1 J9.2 J9.3 J9.4 J9.5 J9.6 J9.7 J9.8 J9.9 J9.10 J9.11 J9.12 19.05,2.54 J7.15 | 54.29,33.18 54.61,33.18 | U1.8 53.66,40.8 52.86,40.8 v52.86,39.24 52.86,34.45 52.7,34.45 52.07,33.81 48.42,33.81 45.72,31.11 45.72,23.5 44.13,23.5 44.07,23.37 | v29.21,15.24 26.51,15.24 | 26.51,15.24 24.13,15.24 v24,15.37 | 26.51,15.24 26.51,13.65 v26.42,13.59 | 44.07,23.37 44.13,23.18 48.58,18.73 52.23,18.73 U6.5P 52.39,18.73 53.82,18.73 54.29,18.26 C8.1 54.42,20.83 54.42,21.28 v55.88,22.73 R10.2 R11.2
  Bottom 0.406: v34.04,21.59 32.77,21.59 29.97,18.8 25.53,18.8 24,20.32 v22.99,20.32 | 16.57,29.91 15.88,30.61 15.88,31.27 | 15.88,31.27 15.88,36.7 | 15.88,36.7 15.88,36.87 | 23.34,16.76 16.89,16.76 v17.02,16.89 17.02,10.67 J7.15 | v16.51,29.84 16.57,29.91 | 15.88,31.27 v15.75,31.24 | v24,15.37 23.34,16.03 23.34,17.81 22.99,18.16 v22.99,20.32 | v22.99,20.32 22.23,20.32 21.34,21.21 21.34,25.15 16.57,29.91 | J11.2 53.08,39.36 52.86,39.15 | 52.83,39.12 52.86,39.15 | 52.86,39.15 v52.86,39.24 | J10.2 v55.87,22.73 v55.88,22.73 | JP1.2 11.3,38.48 14.22,38.48 15.88,36.83 15.88,36.7
VDDCORE
  Top 0.203: C6.1 19.68,16.99 20.8,15.88 U5.43
XT1
  Top 0.203: C11.1 21.9,11.46 | 21.9,11.46 X1.P$1 | U5.1 22.37,11.93 21.9,11.46
XT2
  Top 0.203: U5.2 24.38,11.88 24.38,10.98 22.79,9.4 C10.1 20.07,9.4 19.81,9.65 19.81,10.87 X1.P$2

### Text on the board
tPlace: Power Storage Cell | En | VBUS | 9 | 5 | SCL | SDA | VBAT | 13 | 12 | 11 | ~ | 10 | ~ | ~ | 6 | ~ | K | Power | RFM9x / LoRa | GND | A0 | A1 | A2 | A3 | A4 | A5 | SCK | MOS | MIS | RX0 | TX1 | io2 | RST | VDD | ARf | GND | VDD | Reset | SOLoRa
bPlace: https://github.com/180Studios/solora | Rev 1.1 | SOLoRa | VDD | RFM9x LoRa Radio / Featherwing compatible | GND | ATSAMD21G18 (M0) | Dev / EUI | <-QWIIC-> | 21 | 20 | BAT | En | 13 | 12 | 9~ | 6 | 5 | SCL | SDA | VBUS | 11~ | 10~ | ~ | VBAT | Radio uses: / MISO/MOSI/SCK 4-RST,3-IRQ,8-CS | Power In: / Solar Cell / -or- / LiPoly Batt | Accel 6-INT | GND | RST | 3V | ARf | GND | A0 | A2 | A3 | A4 | A5 | SCK | 24 | MOSI | 23 | MISO | GND | A1 | 22 | RX | TX | Antenna | 0 | 1 | io2 | VDD | GND | VDD
Measures: (59.69MM) | (50.8MM)